# Altium schematic sheet meltdown_interface.SchDoc
size A4; SheetNumber: 3; SheetTotal: 4
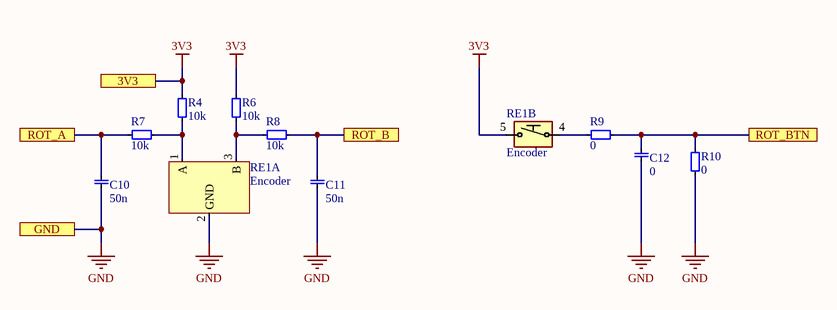
[diagram p0: meltdown_interface.SchDoc]

## Parts
C10  value 50n  [0603 cap]  (hidden comment: 0603, capacitor)
C11  value 50n  [0603 cap]  (hidden comment: 0603, capacitor)
C12  value 0  [0603 cap]  (hidden comment: 0603, capacitor)
R4  value 10k  [0603]  (hidden comment: 0603, resistor)
R6  value 10k  [0603]  (hidden comment: 0603, resistor)
R7  value 10k  [0603]  (hidden comment: 0603, resistor)
R8  value 10k  [0603]  (hidden comment: 0603, resistor)
R9  value 0  [0603]  (hidden comment: 0603, resistor)
R10  value 0  [0603]  (hidden comment: 0603, resistor)
RE1  Encoder  [RotaryEncoder]  (parts A,B of 2)

## Ports
3V3 (see meltdown_hardware[4B]), GND (see meltdown_hardware[4B]), ROT_A (see meltdown_hardware[4B]), ROT_B (see meltdown_hardware[4B]), ROT_BTN (see meltdown_hardware[4B])

## Nets
3V3: R4.0 R6.0 RE1.5(B) ; port 3V3
GND: C10.0 C11.0 C12.0 R10.1 RE1.2(GND) ; port GND
ROT_A: C10.1 R7.0 ; port ROT_A
ROT_B: C11.1 R8.0 ; port ROT_B
ROT_BTN: C12.1 R9.1 R10.0 ; port ROT_BTN
NetR4_1: R4.1 R7.1 RE1.1(A)
NetR6_1: R6.1 R8.1 RE1.3(B)
NetR9_0: R9.0 RE1.4(B)

## Library data of the parts
RE1 = Rotary Encoder with Button
C10-C12 = 0603, capacitor: Order number: *